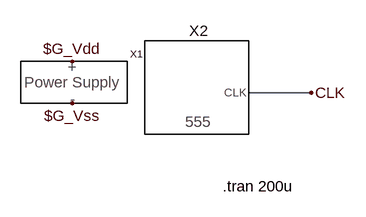
[diagram p0: schematic clock_gen_test.asc]
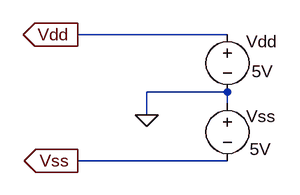
[diagram p1: sub-circuit tpower.asc]
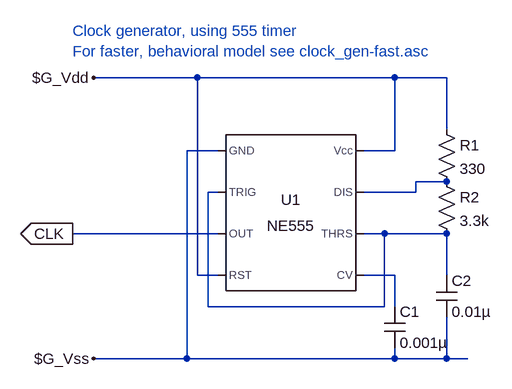
[diagram p2: sub-circuit clock_gen.asc]
clock_gen_test.asc, the LTspice schematic file:
Version 4
SHEET 1 880 680
WIRE 304 160 208 160
FLAG 304 160 CLK
FLAG -64 112 $G_Vdd
FLAG -64 176 $G_Vss
SYMBOL tpower -64 144 R0
SYMATTR InstName X1
SYMBOL clock_gen 128 80 R0
SYMATTR InstName X2
TEXT 168 304 Left 0 !.tran 200u

tpower.asc, the sub-circuit schematic file:
Version 4
SHEET 1 880 680
WIRE -112 32 -320 32
WIRE -112 112 -224 112
WIRE -112 128 -112 112
WIRE -224 144 -224 112
WIRE -112 208 -320 208
FLAG -224 144 0
FLAG -320 32 Vdd
IOPIN -320 32 Out
FLAG -320 208 Vss
IOPIN -320 208 Out
SYMBOL voltage -112 16 R0
WINDOW 0 26 26 Left 0
WINDOW 3 34 68 Left 0
SYMATTR InstName Vdd
SYMATTR Value 5V
SYMBOL voltage -112 112 R0
WINDOW 0 26 34 Left 0
WINDOW 3 31 80 Left 0
SYMATTR InstName Vss
SYMATTR Value 5V

clock_gen.asc, the sub-circuit schematic file:
Version 4
SHEET 1 880 680
WIRE -16 -32 -176 -32
WIRE 288 -32 -16 -32
WIRE 368 -32 288 -32
WIRE 368 48 368 -32
WIRE 16 80 -32 80
WIRE 288 80 288 -32
WIRE 288 80 240 80
WIRE 368 128 320 128
WIRE 16 144 0 144
WIRE 320 144 320 128
WIRE 320 144 240 144
WIRE 16 208 -208 208
WIRE 272 208 240 208
WIRE 368 208 272 208
WIRE -16 272 -16 -32
WIRE 16 272 -16 272
WIRE 288 272 240 272
WIRE 368 272 368 208
WIRE 0 320 0 144
WIRE 272 320 272 208
WIRE 272 320 0 320
WIRE 288 320 288 272
WIRE -32 400 -32 80
WIRE -32 400 -176 400
WIRE 288 400 288 384
WIRE 288 400 -32 400
WIRE 368 400 368 336
WIRE 368 400 288 400
WIRE 400 400 368 400
FLAG -176 400 $G_Vss
FLAG -208 208 CLK
IOPIN -208 208 Out
FLAG -176 -32 $G_Vdd
SYMBOL Misc\\NE555 128 176 R0
SYMATTR InstName U1
SYMBOL cap 272 320 R0
SYMATTR InstName C1
SYMATTR Value 0.001µ
SYMBOL cap 352 272 R0
SYMATTR InstName C2
SYMATTR Value 0.01µ
SYMBOL res 352 112 R0
SYMATTR InstName R2
SYMATTR Value 3.3k
SYMBOL res 352 32 R0
SYMATTR InstName R1
SYMATTR Value 330
TEXT -208 -104 Left 0 ;Clock generator, using 555 timer\nFor faster, behavioral model see clock_gen-fast.asc

The netlist it stands for:
* clock_gen_test.asc
XX1 $G_Vdd $G_Vss tpower
XX2 CLK clock_gen

* block symbol definitions
.subckt tpower Vdd Vss
Vdd Vdd 0 5V
Vss 0 Vss 5V
.ends tpower

.subckt clock_gen CLK
XU1 $G_Vss N002 CLK $G_Vdd N003 N002 N001 $G_Vdd NE555  ; pins GND TRIG OUT RST CV THRS DIS Vcc
C1 N003 $G_Vss 0.001µ
C2 N002 $G_Vss 0.01µ
R2 N001 N002 3.3k
R1 $G_Vdd N001 330
* Clock generator, using 555 timer
* For faster, behavioral model see clock_gen-fast.asc
.ends clock_gen

.tran 200u
.lib NE555.sub
.backanno
.end